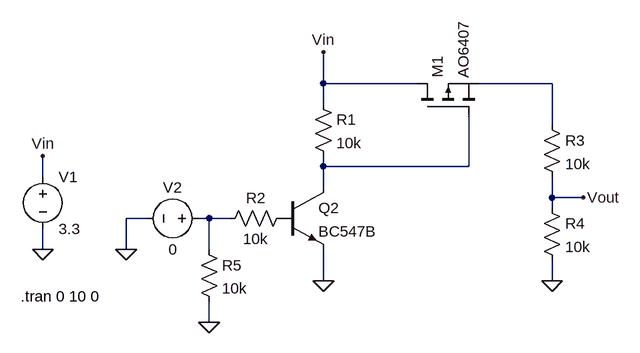
[diagram p0: schematic Draft3.asc]
Draft3.asc, the LTspice schematic file:
Version 4
SHEET 1 968 680
WIRE 496 -32 496 -80
WIRE 640 -32 496 -32
WIRE 848 -32 736 -32
WIRE 496 0 496 -32
WIRE 848 32 848 -32
WIRE 496 96 496 80
WIRE 720 96 720 16
WIRE 720 96 496 96
WIRE 64 112 64 80
WIRE 496 128 496 96
WIRE 848 144 848 112
WIRE 896 144 848 144
WIRE 848 160 848 144
WIRE 224 176 192 176
WIRE 320 176 304 176
WIRE 352 176 320 176
WIRE 64 224 64 192
WIRE 192 224 192 176
WIRE 320 224 320 176
WIRE 496 272 496 224
WIRE 848 272 848 240
WIRE 320 336 320 304
FLAG 64 224 0
FLAG 64 80 Vin
FLAG 192 224 0
FLAG 496 272 0
FLAG 496 -80 Vin
FLAG 848 272 0
FLAG 896 144 Vout
FLAG 320 336 0
SYMBOL voltage 64 96 R0
SYMATTR InstName V1
SYMATTR Value 3.3
SYMBOL res 480 -16 R0
SYMATTR InstName R1
SYMATTR Value 10k
SYMBOL res 448 160 R90
WINDOW 0 0 56 VBottom 2
WINDOW 3 32 56 VTop 2
SYMATTR InstName R2
SYMATTR Value 10k
SYMBOL npn 432 128 R0
SYMATTR InstName Q2
SYMATTR Value BC547B
SYMBOL voltage 320 176 R90
WINDOW 0 -32 56 VBottom 2
WINDOW 3 32 56 VTop 2
SYMATTR InstName V2
SYMATTR Value 0
SYMBOL pmos 640 16 R270
SYMATTR InstName M1
SYMATTR Value AO6407
SYMBOL res 832 16 R0
SYMATTR InstName R3
SYMATTR Value 10k
SYMBOL res 832 144 R0
SYMATTR InstName R4
SYMATTR Value 10k
SYMBOL res 304 208 R0
SYMATTR InstName R5
SYMATTR Value 10k
TEXT 30 296 Left 2 !.tran 0 10 0

The netlist it stands for:
* Draft3.asc
V1 Vin 0 3.3
R1 Vin N002 10k
R2 P001 N003 10k
Q2 N002 P001 0 0 BC547B
V2 N003 0 0
M1 Vin N002 N001 N001 AO6407
R3 N001 Vout 10k
R4 Vout 0 10k
R5 N003 0 10k
.model NPN NPN
.model PNP PNP
.lib standard.bjt
.model NMOS NMOS
.model PMOS PMOS
.lib standard.mos
.tran 0 10 0
.backanno
.end